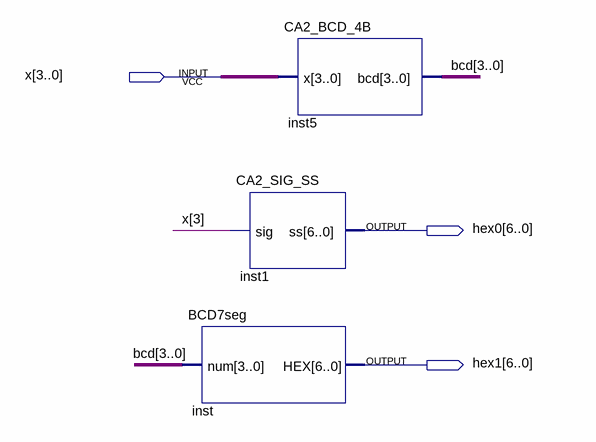
[diagram p0: schematic sheet]
// Quartus schematic CA2_SS_4B.bdf as structural Verilog: 3 symbols, 3 pins
module CA2_SS_4B (
  input  [3:0] x,
  output [6:0] hex0,
  output [6:0] hex1
);

  wire [3:0] bcd;

  BCD7seg inst (.num(bcd), .HEX(hex1));
  CA2_BCD_4B inst5 (.x(x), .bcd(bcd));
  CA2_SIG_SS inst1 (.sig(x[3]), .ss(hex0));
endmodule
